# EAGLE schematic oldARK (EAGLE 9.5.1)
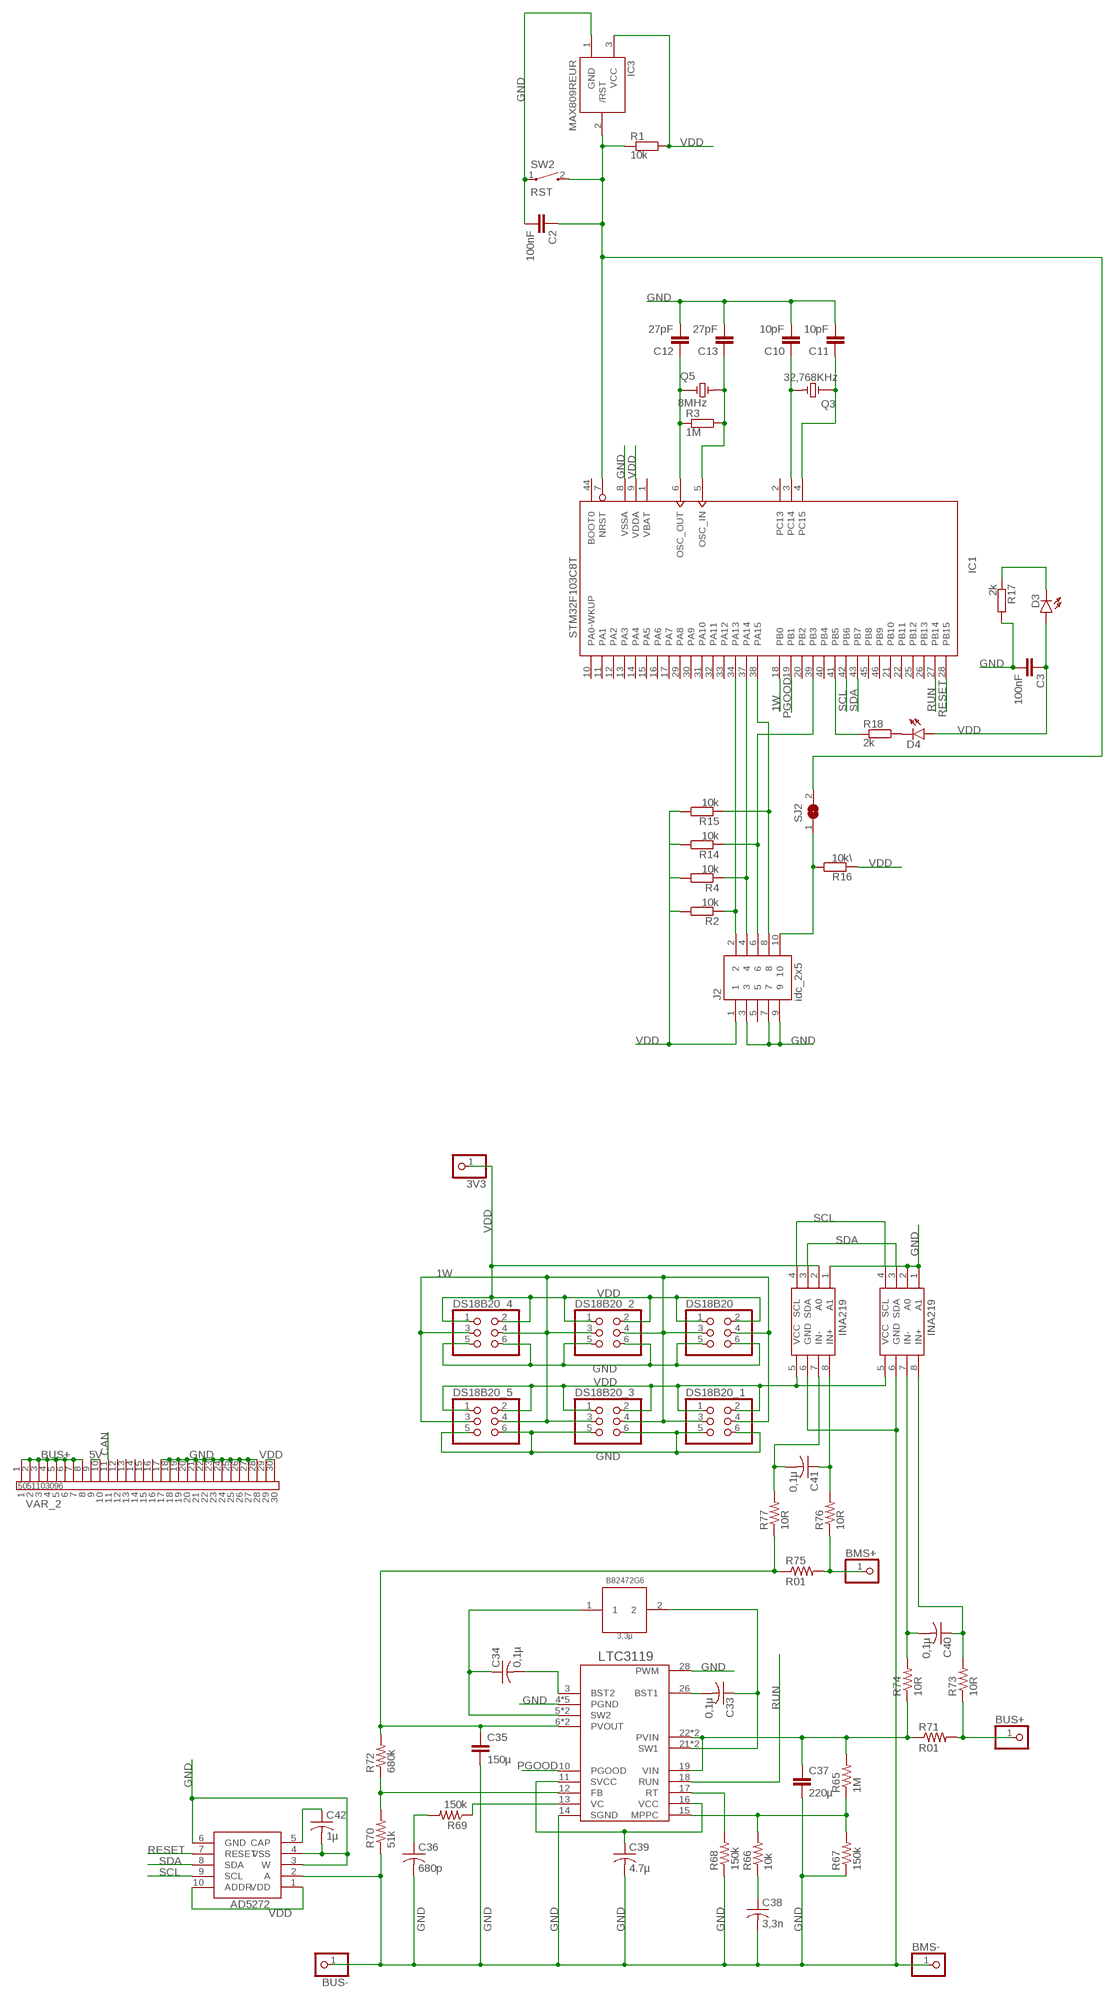
[diagram p0: schematic, sheet 1]

## Parts
3,3µH  3,3µ  B82472G6  [B82472G6]
3V3  PINHD-1X1  [1X01]
BMS+  PINHD-1X1  [1X01]
BMS-  PINHD-1X1  [1X01]
BUS+  PINHD-1X1  [1X01]
BUS-  PINHD-1X1  [1X01]
C2  100nF  C-EUC0603  [C0603]
C3  100nF  C-EUC0603  [C0603]
C10  10pF  C-EUC0603  [C0603]
C11  10pF  C-EUC0603  [C0603]
C12  27pF  C-EUC0603  [C0603]
C13  27pF  C-EUC0603  [C0603]
C33  0,1µ  C-USC0603  [C0603]
C34  0,1µ  C-USC0603  [C0603]
C35  150µ  ECAPECAP150  [ECAP150]
C36  680p  C-USC1206  [C1206]
C37  220µ  ECAPECAP220  [ECAP220]
C38  3,3n  C-USC1206  [C1206]
C39  4.7µ  C-USC1206  [C1206]
C40  0,1µ  C-USC0603  [C0603]
C41  0,1µ  C-USC0603  [C0603]
C42  1µ  C-USC0603  [C0603]
D3  HLMP6  [HLMP6]
D4  HLMP6  [HLMP6]
DS18B20  PINHD-2X3M  [2X03M]
DS18B20_1  PINHD-2X3M  [2X03M]
DS18B20_2  PINHD-2X3M  [2X03M]
DS18B20_3  PINHD-2X3M  [2X03M]
DS18B20_4  PINHD-2X3M  [2X03M]
DS18B20_5  PINHD-2X3M  [2X03M]
IC1  STM32F103C8T  [LQFP48]
IC3  MAX809REUR  MAX809EUR  [SOT23]
J2  idc_2x5  3221-10-0100-00  [CNC_3221-10-0100-00]
Q3  32,768KHz  9C-8.000MEEJ-T  [XTAL_9C-8.000MEEJ-T]
Q5  8MHz  9C-8.000MEEJ-T  [XTAL_9C-8.000MEEJ-T]
R1  10k  BVS  [BVS]
R2  10k  BVS  [BVS]
R3  1M  BVS  [BVS]
R4  10k  BVS  [BVS]
R14  10k  BVS  [BVS]
R15  10k  BVS  [BVS]
R16  10k\  BVS  [BVS]
R17  2k  BVS  [BVS]
R18  2k  BVS  [BVS]
R65  1M  R-US_R0603  [R0603]
R66  10k  R-US_R0603  [R0603]
R67  150k  R-US_R0603  [R0603]
R68  150k  R-US_R0603  [R0603]
R69  150k  R-US_R0603  [R0603]
R70  51k  R-US_R0603  [R0603]
R71  R01  R-US_R2512  [R2512]
R72  680k  R-US_R0603  [R0603]
R73  10R  R-US_R0603  [R0603]
R74  10R  R-US_R0603  [R0603]
R75  R01  R-US_R2512  [R2512]
R76  10R  R-US_R0603  [R0603]
R77  10R  R-US_R0603  [R0603]
SJ2  SJW  [SJW]
SW2  RST  1437566-3  [SW_1437566-3]
U$4  5051103096  [5051103096]
U$57  INA219AID  [INA219AID]
U$58  INA219AID  [INA219AID]
U$59  LTC3119  [LTC3119]
U$60  AD5272  [AD5272]

## Nets
1W: DS18B20.3 DS18B20.4 DS18B20_1.3 DS18B20_1.4 DS18B20_2.3 DS18B20_2.4 DS18B20_3.3 DS18B20_3.4 DS18B20_4.3 DS18B20_4.4 DS18B20_5.3 DS18B20_5.4 IC1.18(PB0)
5V: U$4.9 U$4.10
BUS+: U$4.1 U$4.2 U$4.3 U$4.4 U$4.5 U$4.6 U$4.7 U$4.8
GND: BMS-.1 BUS-.1 C2.2 C3.2 C10.2 C11.2 C12.2 C13.2 C35.P$2 C36.2 C37.P$2 C38.2 C39.2 C42.2 DS18B20.5 DS18B20.6 DS18B20_1.5 DS18B20_1.6 DS18B20_2.5 DS18B20_2.6 DS18B20_3.5 DS18B20_3.6 DS18B20_4.5 DS18B20_4.6 DS18B20_5.5 DS18B20_5.6 IC1.8(VSSA) IC3.1(GND) J2.3 J2.7 J2.9 R17.1 R67.1 R68.1 R70.1 SW2.1 U$4.17 U$4.18 U$4.19 U$4.20 U$4.21 U$4.22 U$4.23 U$4.24 U$4.25 U$4.26 U$4.27 U$4.28 U$57.1(A1) U$57.6(GND) U$58.1(A1) U$58.2(A0) U$58.6(GND) U$59.4(PGND) U$59.9(PGND) U$59.14(SGND) U$59.20(PGND) U$59.25(PGND) U$59.28(PWM) U$59.29(PGND) U$60.2(A) U$60.3(W) U$60.4(VSS) U$60.6(GND)
N$1: C2.1 IC1.7(NRST) IC3.2(/RST) R1.2 SJ2.2 SW2.2
N$2: C11.1 IC1.4(PC15) Q3.1
N$3: C10.1 IC1.3(PC14) Q3.2
N$5: IC1.34(PA13) J2.2 R2.2
N$6: C12.1 IC1.6(OSC_OUT) Q5.1 R3.2
N$7: C13.1 IC1.5(OSC_IN) Q5.2 R3.1
N$9: IC1.37(PA14) J2.4 R4.2
N$10: IC1.38(PA15) J2.8 R15.2
N$11: IC1.39(PB3) J2.6 R14.2
N$12: J2.10 R16.1 SJ2.1
N$14: D3.K R17.2
N$15: D4.K R18.1
N$16: IC1.41(PB5) R18.2
N$129: C34.2 U$59.3(BST2)
N$131: 3,3µH.2 C33.1 U$59.21(SW1) U$59.24(SW1)
N$132: 3,3µH.1 C34.1 U$59.5(SW2) U$59.8(SW2)
N$134: C35.P$1 R72.2 R75.1 R77.1 U$59.6(PVOUT) U$59.7(PVOUT)
N$135: R69.1 U$59.13(VC)
N$136: C36.1 R69.2
N$137: C37.P$1 R65.2 R71.1 R74.1 U$59.19(VIN) U$59.22(PVIN) U$59.23(PVIN)
N$138: R65.1 R66.2 R67.2 U$59.15(MPPC)
N$139: C38.1 R66.1
N$140: C39.1 U$59.11(SVCC) U$59.16(VCC)
N$141: C40.2 R74.2 U$58.7(IN-)
N$142: R68.2 U$59.17(RT)
N$143: R70.2 R72.1 U$59.12(FB)
N$144: C33.2 U$59.26(BST1)
N$146: BUS+.1 R71.2 R73.1
N$147: C40.1 R73.2 U$58.8(IN+)
N$149: BMS+.1 R75.2 R76.1
N$150: C41.1 R76.2 U$57.8(IN+)
N$151: C41.2 R77.2 U$57.7(IN-)
N$154: C42.1 U$60.5(CAP)
PGOOD: IC1.19(PB1) U$59.10(PGOOD)
RESET: IC1.28(PB15) U$60.7(RESET)
RUN: IC1.27(PB14) U$59.18(RUN)
SCL: IC1.42(PB6) U$57.4(SCL) U$58.4(SCL) U$60.9(SCL)
SDA: IC1.43(PB7) U$57.3(SDA) U$58.3(SDA) U$60.8(SDA)
VDD: 3V3.1 C3.1 D3.A D4.A DS18B20.1 DS18B20.2 DS18B20_1.1 DS18B20_1.2 DS18B20_2.1 DS18B20_2.2 DS18B20_3.1 DS18B20_3.2 DS18B20_4.1 DS18B20_4.2 DS18B20_5.1 DS18B20_5.2 IC1.9(VDDA) IC3.3(VCC) J2.1 R1.1 R2.1 R4.1 R14.1 R15.1 R16.2 U$4.29 U$4.30 U$57.2(A0) U$57.5(VCC) U$58.5(VCC) U$60.1(VDD) U$60.10(ADDR)
Unconnected: IC1.2(PC13) IC1.10(PA0-WKUP) IC1.11(PA1) IC1.12(PA2) IC1.13(PA3) IC1.14(PA4) IC1.15(PA5) IC1.16(PA6) IC1.17(PA7) IC1.20(PB2) IC1.21(PB10) IC1.22(PB11) IC1.25(PB12) IC1.26(PB13) IC1.29(PA8) IC1.30(PA9) IC1.31(PA10) IC1.32(PA11) IC1.33(PA12) IC1.40(PB4) IC1.44(BOOT0) IC1.45(PB8) IC1.46(PB9) J2.5 U$4.11 U$4.12 U$4.13 U$4.14 U$4.15 U$4.16

## Notes on the sheet
- VAR_2

## Power pins joined to a net without a drawn wire
VBAT: IC1.1(VBAT)
VDD: IC1.24(VDD) IC1.36(VDD) IC1.48(VDD)
VSS: IC1.23(VSS) IC1.35(VSS) IC1.47(VSS)

## Library data of the parts
3,3µH = CanCubeSat:B82472G6
3V3 BMS+ BMS- BUS+ BUS- = pinhead:PINHD-1X1: PIN HEADER
C2 C3 C10-C13 = rcl:C-EU: CAPACITOR, European symbol; SPICEPREFIX: C
C33 C34 C36 C38-C42 = rcl:C-US: CAPACITOR, American symbol; SPICEPREFIX: C
C35 C37 = CanCubeSat:ECAP
D3 D4 = display-hp:HLMP6: LED 2mm horizontal; MF: AGILENT TECHNOLOGIES; MPN: HLMP-6500; OC_FARNELL: 1652490; OC_NEWARK: 40K0088
DS18B20 DS18B20_1-DS18B20_5 = pinheadCS:PINHD-2X3: PIN HEADER
IC1 = micro-stm:STM32F103C*T: ARM 32-bit Cortex™-M3 CPU 72 MHz maximum frequency 16 to 128 Kbytes of Flash memory 6 to 20 kbytes of SRAM 37 GPIOs 2.0 to 3.6 V application supply
IC3 = MAX809_:MAX809*: 3-Pin Microprocessor Reset Circuit; AVAILABILITY: Unavailable; DESCRIPTION: ON Semiconductor ANA 1.20V MCROPROC RESET; MF: ON Semiconductor; MP: MAX809; PACKAGE: SOT-23 Maxim Integrated; PRICE: None
J2 = idc_2x5:3221-10-0100-00: Idc Box Header .050" 10pos; AVAILABILITY: Unavailable; DESCRIPTION: Idc Box Header .050 10pos; MF: CNC Tech; MP: 3221-10-0100-00; PACKAGE: None; PRICE: None
Q3 Q5 = 9C-8.000MEEJ-T:9C-8.000MEEJ-T: Crystal, 8mhz, 18pf, Hc-49s; AVAILABILITY: Unavailable; DESCRIPTION: Crystal, 8mhz, 18pf, Hc-49s; MF: TXC CORPORATION; MP: 9C-8.000MEEJ-T; PACKAGE: HC49/US TXC; PRICE: None
R1-R4 R14-R18 = resistor-shunt:BVS: SMD SHUNT RESISTOR; OC_FARNELL: unknown; OC_NEWARK: unknown
R65-R70 R72-R74 R76 R77 = resistor:R-US_: RESISTOR, American symbol
R71 R75 = rcl:R-US_: RESISTOR, American symbol; SPICEPREFIX: R
SJ2 = jumper:SJ: SMD solder JUMPER
SW2 = 1437566-3:1437566-3: Switch Tactile OFF (ON) SPST Rectangular Button Gull Wing 0.05A 12VDC SMD Loose Piece; AVAILABILITY: Unavailable; COMMENT: 1437566-3; CONFIGURATION_POLE-THROW: Single Pole - Single Throw; CONTACT_CURRENT_RATING: 50 mA; DESCRIPTION: Switch Tactile OFF _ON_ SPST Rectangular Button Gull Wing 0.05A 12VDC SMD Loose Piece; MF: TE Connectivity; MP: 1437566-3; PACKAGE: None; PRICE: None; TE_PURCHASE_URL: https://www.te.com/usa-en/product-1437566-3.html?te_bu=Cor&te_type=disp&te_campaign=seda_glo_cor-seda-global-disp-prtnr-fy19-seda-model-bom-cta_sma-317_1&elqCampaignId=32493
U$4 = CanCubeSat:5051103096
U$57 U$58 = CanCubeSat:INA219AID
U$59 = CanCubeSat:LTC3119
U$60 = CanCubeSat:AD5272